# EAGLE schematic front pane - v2 (EAGLE 9.2.2)
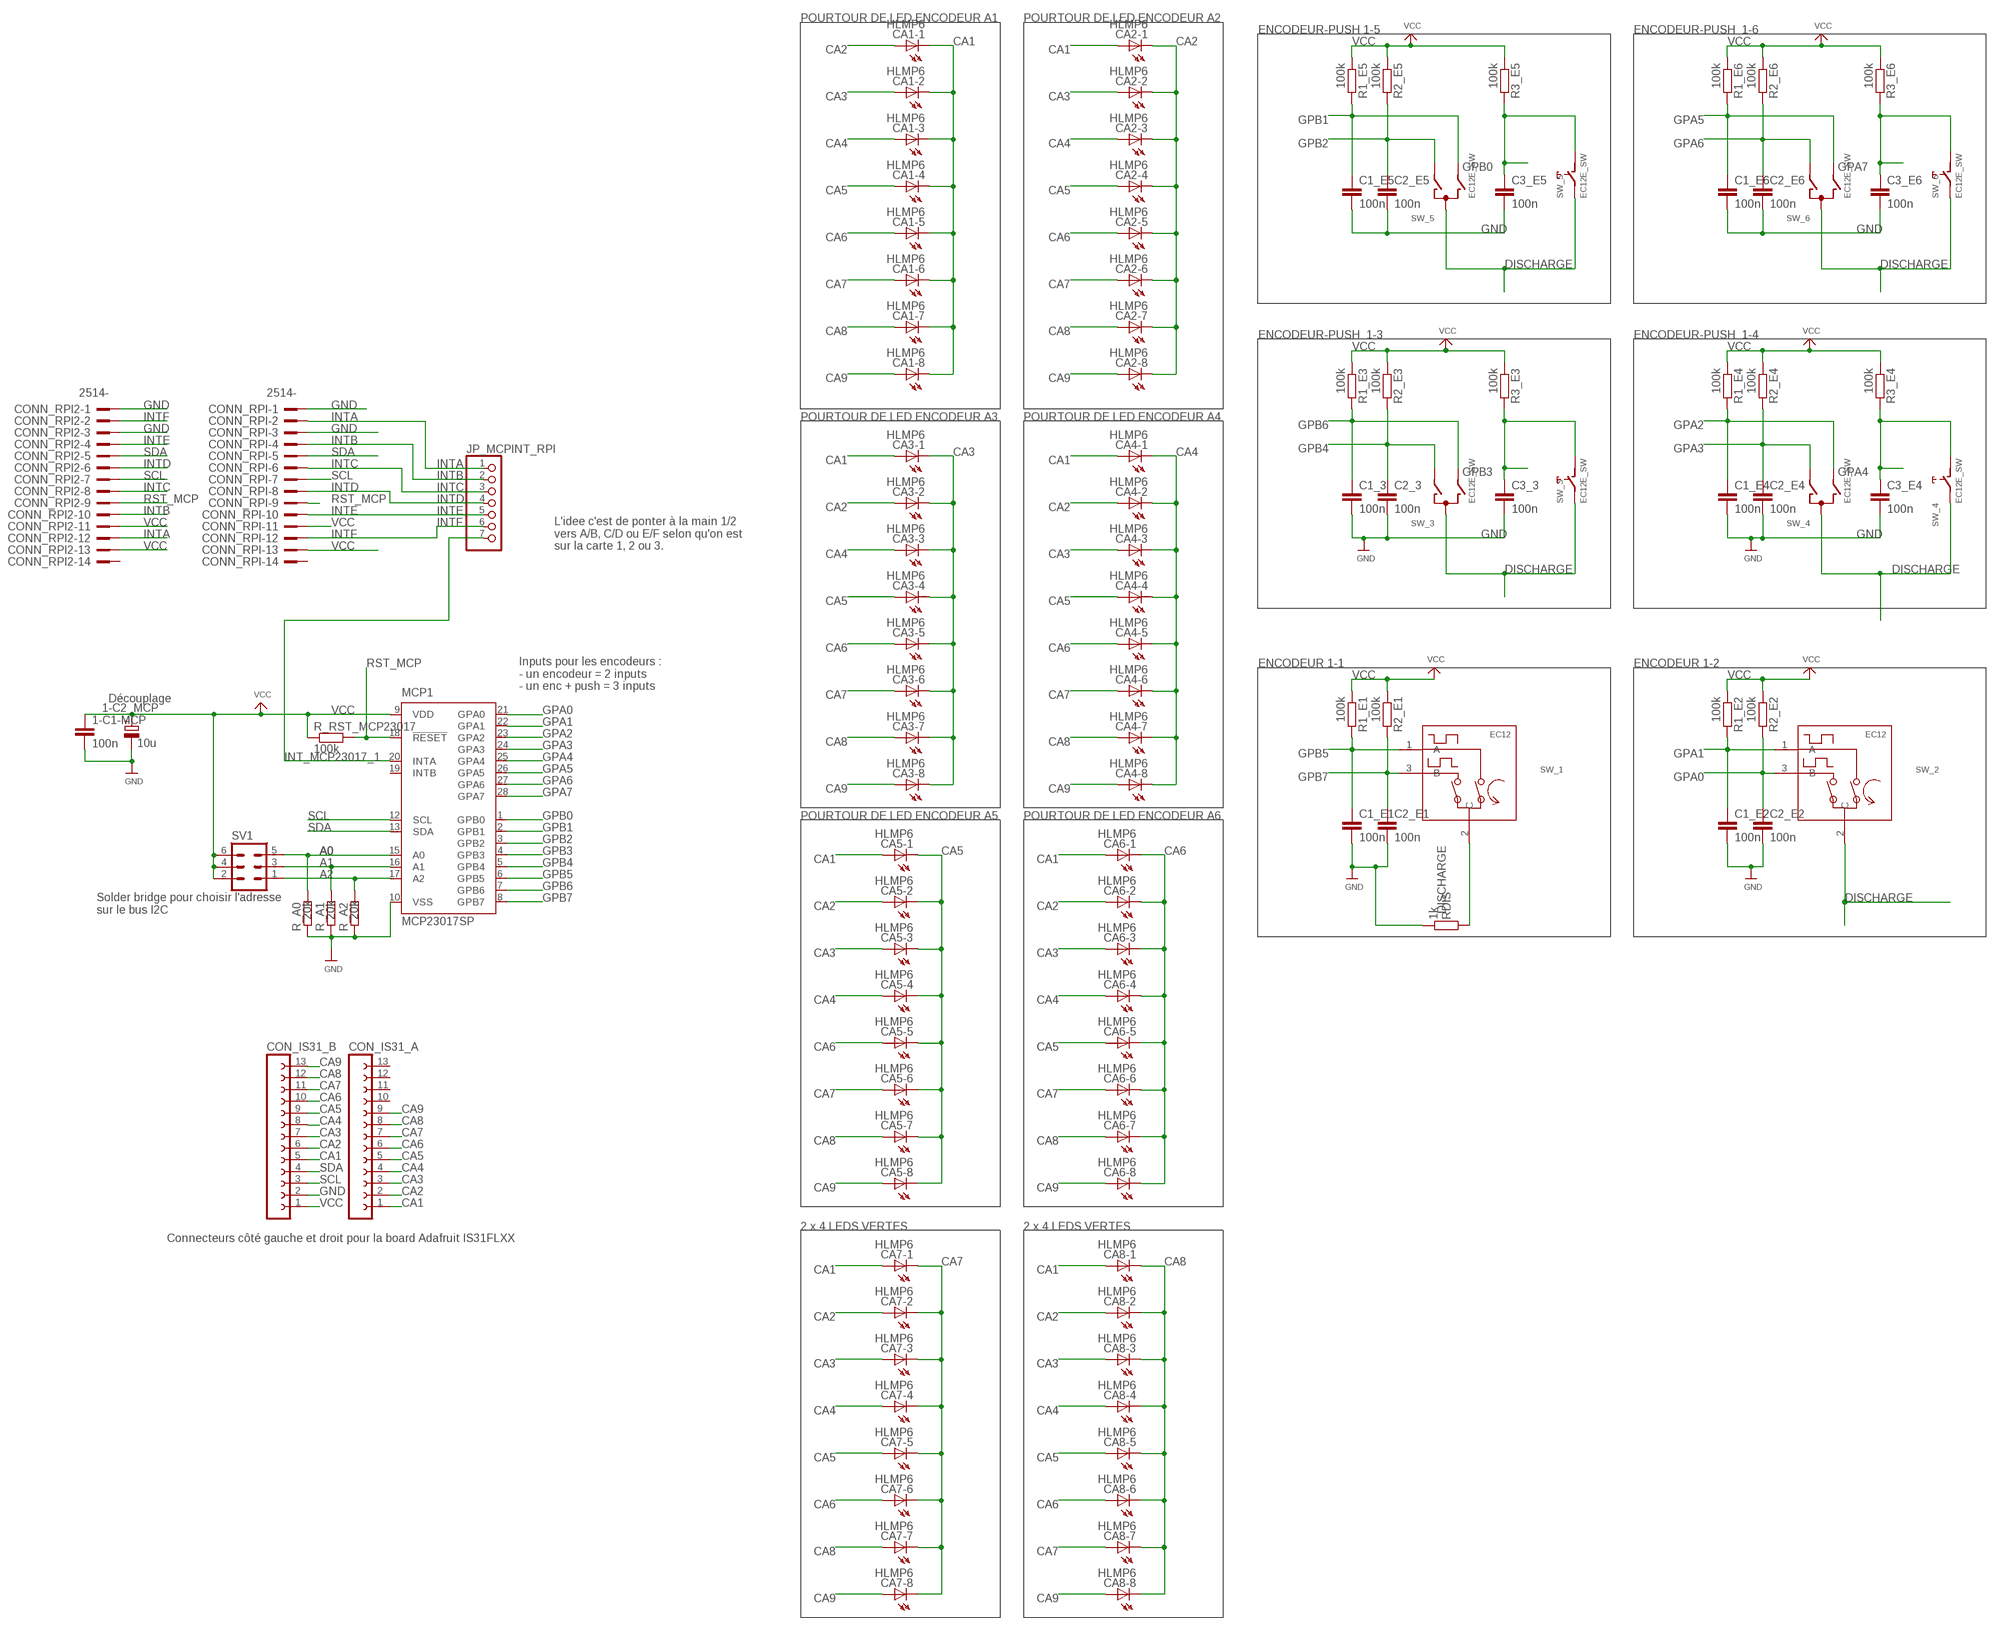
[diagram p0: schematic, sheet 1]

## Parts
1-C1-MCP  100n  C-EU025-024X044  [C025-024X044]
1-C2_MCP  10u  CPOL-EUB45181B  [B45181B]
C1_3  100n  C-EU025-024X044  [C025-024X044]
C1_E1  100n  C-EU025-024X044  [C025-024X044]
C1_E2  100n  C-EU025-024X044  [C025-024X044]
C1_E4  100n  C-EU050-024X044  [C050-024X044]
C1_E5  100n  C-EU025-024X044  [C025-024X044]
C1_E6  100n  C-EU025-024X044  [C025-024X044]
C2_3  100n  C-EU025-024X044  [C025-024X044]
C2_E1  100n  C-EU025-024X044  [C025-024X044]
C2_E2  100n  C-EU025-024X044  [C025-024X044]
C2_E4  100n  C-EU025-024X044  [C025-024X044]
C2_E5  100n  C-EU025-024X044  [C025-024X044]
C2_E6  100n  C-EU025-024X044  [C025-024X044]
C3_3  100n  C-EU025-024X044  [C025-024X044]
C3_E4  100n  C-EU025-024X044  [C025-024X044]
C3_E5  100n  C-EU025-024X044  [C025-024X044]
C3_E6  100n  C-EU025-024X044  [C025-024X044]
CA1-1  HLMP6  [HLMP6]
CA1-2  HLMP6  [HLMP6]
CA1-3  HLMP6  [HLMP6]
CA1-4  HLMP6  [HLMP6]
CA1-5  HLMP6  [HLMP6]
CA1-6  HLMP6  [HLMP6]
CA1-7  HLMP6  [HLMP6]
CA1-8  HLMP6  [HLMP6]
CA2-1  HLMP6  [HLMP6]
CA2-2  HLMP6  [HLMP6]
CA2-3  HLMP6  [HLMP6]
CA2-4  HLMP6  [HLMP6]
CA2-5  HLMP6  [HLMP6]
CA2-6  HLMP6  [HLMP6]
CA2-7  HLMP6  [HLMP6]
CA2-8  HLMP6  [HLMP6]
CA3-1  HLMP6  [HLMP6]
CA3-2  HLMP6  [HLMP6]
CA3-3  HLMP6  [HLMP6]
CA3-4  HLMP6  [HLMP6]
CA3-5  HLMP6  [HLMP6]
CA3-6  HLMP6  [HLMP6]
CA3-7  HLMP6  [HLMP6]
CA3-8  HLMP6  [HLMP6]
CA4-1  HLMP6  [HLMP6]
CA4-2  HLMP6  [HLMP6]
CA4-3  HLMP6  [HLMP6]
CA4-4  HLMP6  [HLMP6]
CA4-5  HLMP6  [HLMP6]
CA4-6  HLMP6  [HLMP6]
CA4-7  HLMP6  [HLMP6]
CA4-8  HLMP6  [HLMP6]
CA5-1  HLMP6  [HLMP6]
CA5-2  HLMP6  [HLMP6]
CA5-3  HLMP6  [HLMP6]
CA5-4  HLMP6  [HLMP6]
CA5-5  HLMP6  [HLMP6]
CA5-6  HLMP6  [HLMP6]
CA5-7  HLMP6  [HLMP6]
CA5-8  HLMP6  [HLMP6]
CA6-1  HLMP6  [HLMP6]
CA6-2  HLMP6  [HLMP6]
CA6-3  HLMP6  [HLMP6]
CA6-4  HLMP6  [HLMP6]
CA6-5  HLMP6  [HLMP6]
CA6-6  HLMP6  [HLMP6]
CA6-7  HLMP6  [HLMP6]
CA6-8  HLMP6  [HLMP6]
CA7-1  HLMP6  [HLMP6]
CA7-2  HLMP6  [HLMP6]
CA7-3  HLMP6  [HLMP6]
CA7-4  HLMP6  [HLMP6]
CA7-5  HLMP6  [HLMP6]
CA7-6  HLMP6  [HLMP6]
CA7-7  HLMP6  [HLMP6]
CA7-8  HLMP6  [HLMP6]
CA8-1  HLMP6  [HLMP6]
CA8-2  HLMP6  [HLMP6]
CA8-3  HLMP6  [HLMP6]
CA8-4  HLMP6  [HLMP6]
CA8-5  HLMP6  [HLMP6]
CA8-6  HLMP6  [HLMP6]
CA8-7  HLMP6  [HLMP6]
CA8-8  HLMP6  [HLMP6]
CON_IS31_A  FE13-1  [FE13]
CON_IS31_B  FE13-1  [FE13]
CONN_RPI  2514-  [PAK100/2500-14]
CONN_RPI2  2514-  [PAK100/2500-14]
JP_MCPINT_RPI  PINHD-1X7  [1X07]
MCP1  MCP23017SP  [DIL28-3]
R1_E1  100k  R-EU_0204/5  [0204/5]
R1_E2  100k  R-EU_0204/5  [0204/5]
R1_E3  100k  R-EU_0204/5  [0204/5]
R1_E4  100k  R-EU_0204/5  [0204/5]
R1_E5  100k  R-EU_0204/5  [0204/5]
R1_E6  100k  R-EU_0204/5  [0204/5]
R2_E1  100k  R-EU_0204/5  [0204/5]
R2_E2  100k  R-EU_0204/5  [0204/5]
R2_E3  100k  R-EU_0204/5  [0204/5]
R2_E4  100k  R-EU_0204/5  [0204/5]
R2_E5  100k  R-EU_0204/5  [0204/5]
R2_E6  100k  R-EU_0204/5  [0204/5]
R3_E3  100k  R-EU_0204/5  [0204/5]
R3_E4  100k  R-EU_0204/5  [0204/5]
R3_E5  100k  R-EU_0204/5  [0204/5]
R3_E6  100k  R-EU_0204/5  [0204/5]
R_A0  20k  R-EU_0204/5  [0204/5]
R_A1  20k  R-EU_0204/5  [0204/5]
R_A2  20k  R-EU_0204/5  [0204/5]
R_RST_MCP23017  100k  R-EU_0204/5  [0204/5]
RDIS  1k  R-EU_0204/5  [0204/5]
SV1  MA03-2  [MA03-2]
SW_1  EC12  [EC12]
SW_2  EC12  [EC12]
SW_3  EC12E_SW  [ALPS_EC12E_SW]
SW_4  EC12E_SW  [ALPS_EC12E_SW]
SW_5  EC12E_SW  [ALPS_EC12E_SW]
SW_6  EC12E_SW  [ALPS_EC12E_SW]

## Nets
A0: MCP1.15(A0) R_A0.2 SV1.5
A1: MCP1.16(A1) R_A1.2 SV1.3
A2: MCP1.17(A2) R_A2.2 SV1.1
CA1: CA1-1.K CA1-2.K CA1-3.K CA1-4.K CA1-5.K CA1-6.K CA1-7.K CA1-8.K CA2-1.A CA3-1.A CA4-1.A CA5-1.A CA6-1.A CA7-1.A CA8-1.A CON_IS31_A.1 CON_IS31_B.5
CA2: CA1-1.A CA2-1.K CA2-2.K CA2-3.K CA2-4.K CA2-5.K CA2-6.K CA2-7.K CA2-8.K CA3-2.A CA4-2.A CA5-2.A CA6-2.A CA7-2.A CA8-2.A CON_IS31_A.2 CON_IS31_B.6
CA3: CA1-2.A CA2-2.A CA3-1.K CA3-2.K CA3-3.K CA3-4.K CA3-5.K CA3-6.K CA3-7.K CA3-8.K CA4-3.A CA5-3.A CA6-3.A CA7-3.A CA8-3.A CON_IS31_A.3 CON_IS31_B.7
CA4: CA1-3.A CA2-3.A CA3-3.A CA4-1.K CA4-2.K CA4-3.K CA4-4.K CA4-5.K CA4-6.K CA4-7.K CA4-8.K CA5-4.A CA6-4.A CA7-4.A CA8-4.A CON_IS31_A.4 CON_IS31_B.8
CA5: CA1-4.A CA2-4.A CA3-4.A CA4-4.A CA5-1.K CA5-2.K CA5-3.K CA5-4.K CA5-5.K CA5-6.K CA5-7.K CA5-8.K CA6-5.A CA7-5.A CA8-5.A CON_IS31_A.5 CON_IS31_B.9
CA6: CA1-5.A CA2-5.A CA3-5.A CA4-5.A CA5-5.A CA6-1.K CA6-2.K CA6-3.K CA6-4.K CA6-5.K CA6-6.K CA6-7.K CA6-8.K CA7-6.A CA8-6.A CON_IS31_A.6 CON_IS31_B.10
CA7: CA1-6.A CA2-6.A CA3-6.A CA4-6.A CA5-6.A CA6-6.A CA7-1.K CA7-2.K CA7-3.K CA7-4.K CA7-5.K CA7-6.K CA7-7.K CA7-8.K CA8-7.A CON_IS31_A.7 CON_IS31_B.11
CA8: CA1-7.A CA2-7.A CA3-7.A CA4-7.A CA5-7.A CA6-7.A CA7-7.A CA8-1.K CA8-2.K CA8-3.K CA8-4.K CA8-5.K CA8-6.K CA8-7.K CA8-8.K CON_IS31_A.8 CON_IS31_B.12
CA9: CA1-8.A CA2-8.A CA3-8.A CA4-8.A CA5-8.A CA6-8.A CA7-8.A CA8-8.A CON_IS31_A.9 CON_IS31_B.13
DISCHARGE: RDIS.1 SW_1.2(C) SW_2.2(C) SW_3.C SW_3.E SW_4.C SW_4.E SW_5.C SW_5.E SW_6.C SW_6.E
GND: 1-C1-MCP.2 1-C2_MCP.- C1_3.2 C1_E1.2 C1_E2.2 C1_E4.2 C1_E5.2 C1_E6.2 C2_3.2 C2_E1.2 C2_E2.2 C2_E4.2 C2_E5.2 C2_E6.2 C3_3.2 C3_E4.2 C3_E5.2 C3_E6.2 CON_IS31_B.2 CONN_RPI2.1 CONN_RPI2.3 CONN_RPI.1 CONN_RPI.3 MCP1.10(VSS) R_A0.1 R_A1.1 R_A2.1 RDIS.2
GPA0: C2_E2.1 MCP1.21(GPA0) R2_E2.2 SW_2.3(B)
GPA1: C1_E2.1 MCP1.22(GPA1) R1_E2.2 SW_2.1(A)
GPA2: C1_E4.1 MCP1.23(GPA2) R1_E4.2 SW_4.B
GPA3: C2_E4.1 MCP1.24(GPA3) R2_E4.2 SW_4.A
GPA4: C3_E4.1 MCP1.25(GPA4) R3_E4.2 SW_4.D
GPA5: C1_E6.1 MCP1.26(GPA5) R1_E6.2 SW_6.B
GPA6: C2_E6.1 MCP1.27(GPA6) R2_E6.2 SW_6.A
GPA7: C3_E6.1 MCP1.28(GPA7) R3_E6.2 SW_6.D
GPB0: C3_E5.1 MCP1.1(GPB0) R3_E5.2 SW_5.D
GPB1: C1_E5.1 MCP1.2(GPB1) R1_E5.2 SW_5.B
GPB2: C2_E5.1 MCP1.3(GPB2) R2_E5.2 SW_5.A
GPB3: C3_3.1 MCP1.4(GPB3) R3_E3.2 SW_3.D
GPB4: C2_3.1 MCP1.5(GPB4) R2_E3.2 SW_3.A
GPB5: C1_E1.1 MCP1.6(GPB5) R1_E1.2 SW_1.1(A)
GPB6: C1_3.1 MCP1.7(GPB6) R1_E3.2 SW_3.B
GPB7: C2_E1.1 MCP1.8(GPB7) R2_E1.2 SW_1.3(B)
INT_MCP23017_1: JP_MCPINT_RPI.7 MCP1.20(INTA)
INTA: CONN_RPI2.12 CONN_RPI.2 JP_MCPINT_RPI.1
INTB: CONN_RPI2.10 CONN_RPI.4 JP_MCPINT_RPI.2
INTC: CONN_RPI2.8 CONN_RPI.6 JP_MCPINT_RPI.3
INTD: CONN_RPI2.6 CONN_RPI.8 JP_MCPINT_RPI.4
INTE: CONN_RPI2.4 CONN_RPI.10 JP_MCPINT_RPI.5
INTF: CONN_RPI2.2 CONN_RPI.12 JP_MCPINT_RPI.6
RST_MCP: CONN_RPI2.9 CONN_RPI.9 MCP1.18(!RESET) R_RST_MCP23017.2
SCL: CON_IS31_B.3 CONN_RPI2.7 CONN_RPI.7 MCP1.12(SCL)
SDA: CON_IS31_B.4 CONN_RPI2.5 CONN_RPI.5 MCP1.13(SDA)
VCC: 1-C1-MCP.1 1-C2_MCP.+ CON_IS31_B.1 CONN_RPI2.11 CONN_RPI2.13 CONN_RPI.11 CONN_RPI.13 MCP1.9(VDD) R1_E1.1 R1_E2.1 R1_E3.1 R1_E4.1 R1_E5.1 R1_E6.1 R2_E1.1 R2_E2.1 R2_E3.1 R2_E4.1 R2_E5.1 R2_E6.1 R3_E3.1 R3_E4.1 R3_E5.1 R3_E6.1 R_RST_MCP23017.1 SV1.2 SV1.4 SV1.6
Unconnected: CON_IS31_A.10 CON_IS31_A.11 CON_IS31_A.12 CON_IS31_A.13 CONN_RPI2.14 CONN_RPI.14 MCP1.19(INTB) SW_3.GND1(G) SW_3.GND2(G) SW_4.GND1(G) SW_4.GND2(G) SW_5.GND1(G) SW_5.GND2(G) SW_6.GND1(G) SW_6.GND2(G)

## Notes on the sheet
- POURTOUR DE LED ENCODEUR A1 | POURTOUR DE LED ENCODEUR A2
- ENCODEUR-PUSH 1-5 | ENCODEUR-PUSH  1-6
- ENCODEUR-PUSH  1-3 | ENCODEUR-PUSH  1-4
- POURTOUR DE LED ENCODEUR A3 | POURTOUR DE LED ENCODEUR A4
- L'idee c'est de ponter à la main 1/2 
  vers A/B, C/D ou E/F selon qu'on est 
  sur la carte 1, 2 ou 3.
- ENCODEUR 1-1 | ENCODEUR 1-2
- Découplage
- Inputs pour les encodeurs :
  - un encodeur = 2 inputs
  - un enc + push = 3 inputs
- POURTOUR DE LED ENCODEUR A5 | POURTOUR DE LED ENCODEUR A6
- Solder bridge pour choisir l'adresse
  sur le bus I2C
- 2 x 4 LEDS VERTES | 2 x 4 LEDS VERTES
- Connecteurs côté gauche et droit pour la board Adafruit IS31FLXX

## Library data of the parts
1-C1-MCP C1_3 C1_E1 C1_E2 C1_E4-C1_E6 C2_3 C2_E1 C2_E2 C2_E4-C2_E6 C3_3 C3_E4-C3_E6 = rcl:C-EU: CAPACITOR, European symbol; SPICEPREFIX: C
1-C2_MCP = rcl:CPOL-EU: POLARIZED CAPACITOR, European symbol; SPICEPREFIX: C
CA1-1-CA1-8 CA2-1-CA2-8 CA3-1-CA3-8 CA4-1-CA4-8 CA5-1-CA5-8 CA6-1-CA6-8 CA7-1-CA7-8 CA8-1-CA8-8 = display-hp:HLMP6: LED 2mm horizontal; MF: AGILENT TECHNOLOGIES; MPN: HLMP-6500; OC_FARNELL: 1652490; OC_NEWARK: 40K0088
CON_IS31_A CON_IS31_B = con-lsta:FE13-1: FEMALE HEADER; OC_FARNELL: unknown; OC_NEWARK: unknown
CONN_RPI CONN_RPI2 = con-3m:2514-: 3M (TM) Pak 100 4-Wall Header Source: 3M; OC_FARNELL: unknown; OC_NEWARK: unknown
JP_MCPINT_RPI = pinhead:PINHD-1X7: PIN HEADER
MCP1 = microchip:MCP23017: http://ww1.microchip.com/downloads/en/DeviceDoc/21952a.pdf Source: http://ww1.microchip.com/downloads/en/DeviceDoc/21952a.pdf; MF: MICROCHIP; MPN: MCP23017-E/SP; OC_FARNELL: 1332088; OC_NEWARK: 31K2959
R1_E1-R1_E6 R2_E1-R2_E6 R3_E3-R3_E6 R_A0 R_A1 R_A2 R_RST_MCP23017 RDIS = resistor:R-EU_: RESISTOR, European symbol
SV1 = con-lstb:MA03-2: PIN HEADER; OC_FARNELL: unknown; OC_NEWARK: unknown
SW_1 SW_2 = rotary-encoder:EC12
SW_3-SW_6 = switch-alps:EC12E_SW: ALPS rotary Encoder EC12E series with switch; MPN: EC12E2424407; OC_FARNELL: 1520813; OC_NEWARK: 74M1068